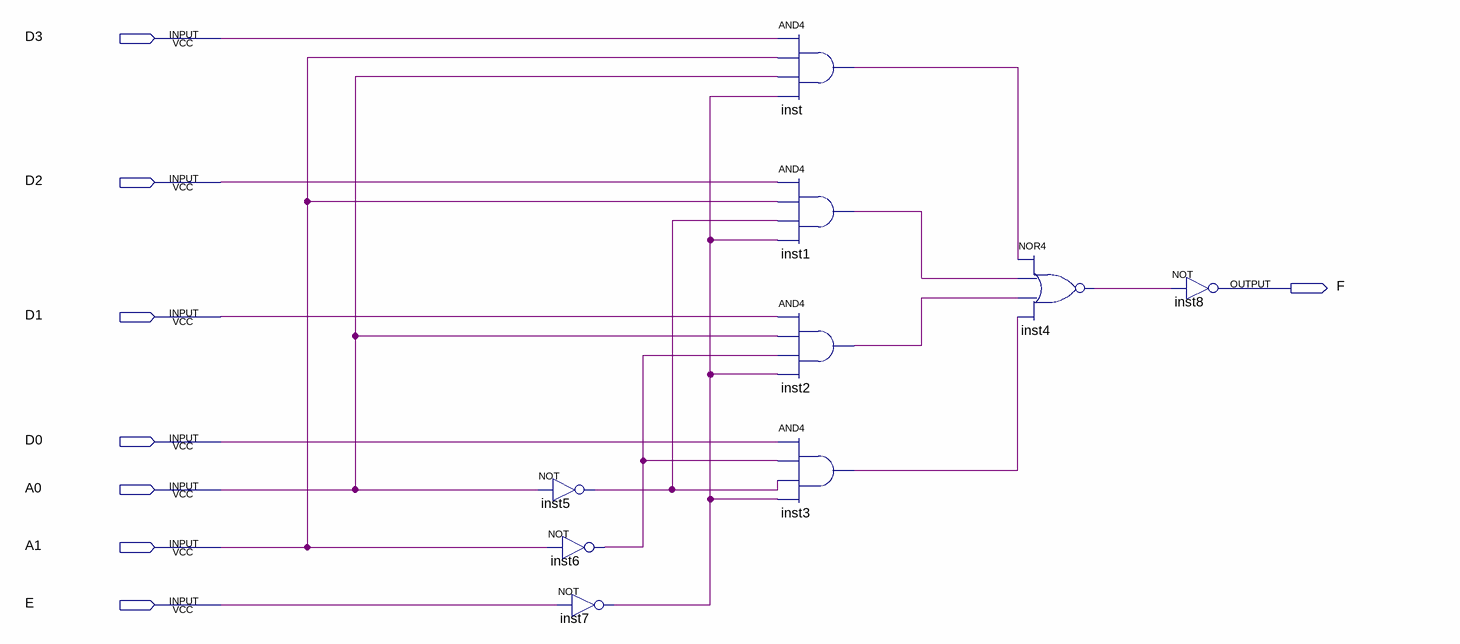
[diagram p0: schematic sheet]
// Quartus schematic xz.bdf as structural Verilog: 9 symbols, 8 pins
module xz (
  input  D3,
  input  D2,
  input  D1,
  input  D0,
  input  A0,
  input  A1,
  input  E,
  output F
);

  wire inst1_out, inst2_out, inst3_out, inst4_out, inst5_out, inst6_out, inst7_out, inst_out;

  not inst5 (inst5_out, A0);
  not inst6 (inst6_out, A1);
  not inst7 (inst7_out, E);
  and inst (inst_out, D3, A1, A0, inst7_out);
  and inst1 (inst1_out, D2, A1, inst5_out, inst7_out);
  and inst2 (inst2_out, D1, A0, inst6_out, inst7_out);
  and inst3 (inst3_out, D0, inst6_out, inst5_out, inst7_out);
  nor inst4 (inst4_out, inst_out, inst1_out, inst2_out, inst3_out);
  not inst8 (F, inst4_out);
endmodule
